# Altium project OBDII.PrjPCB
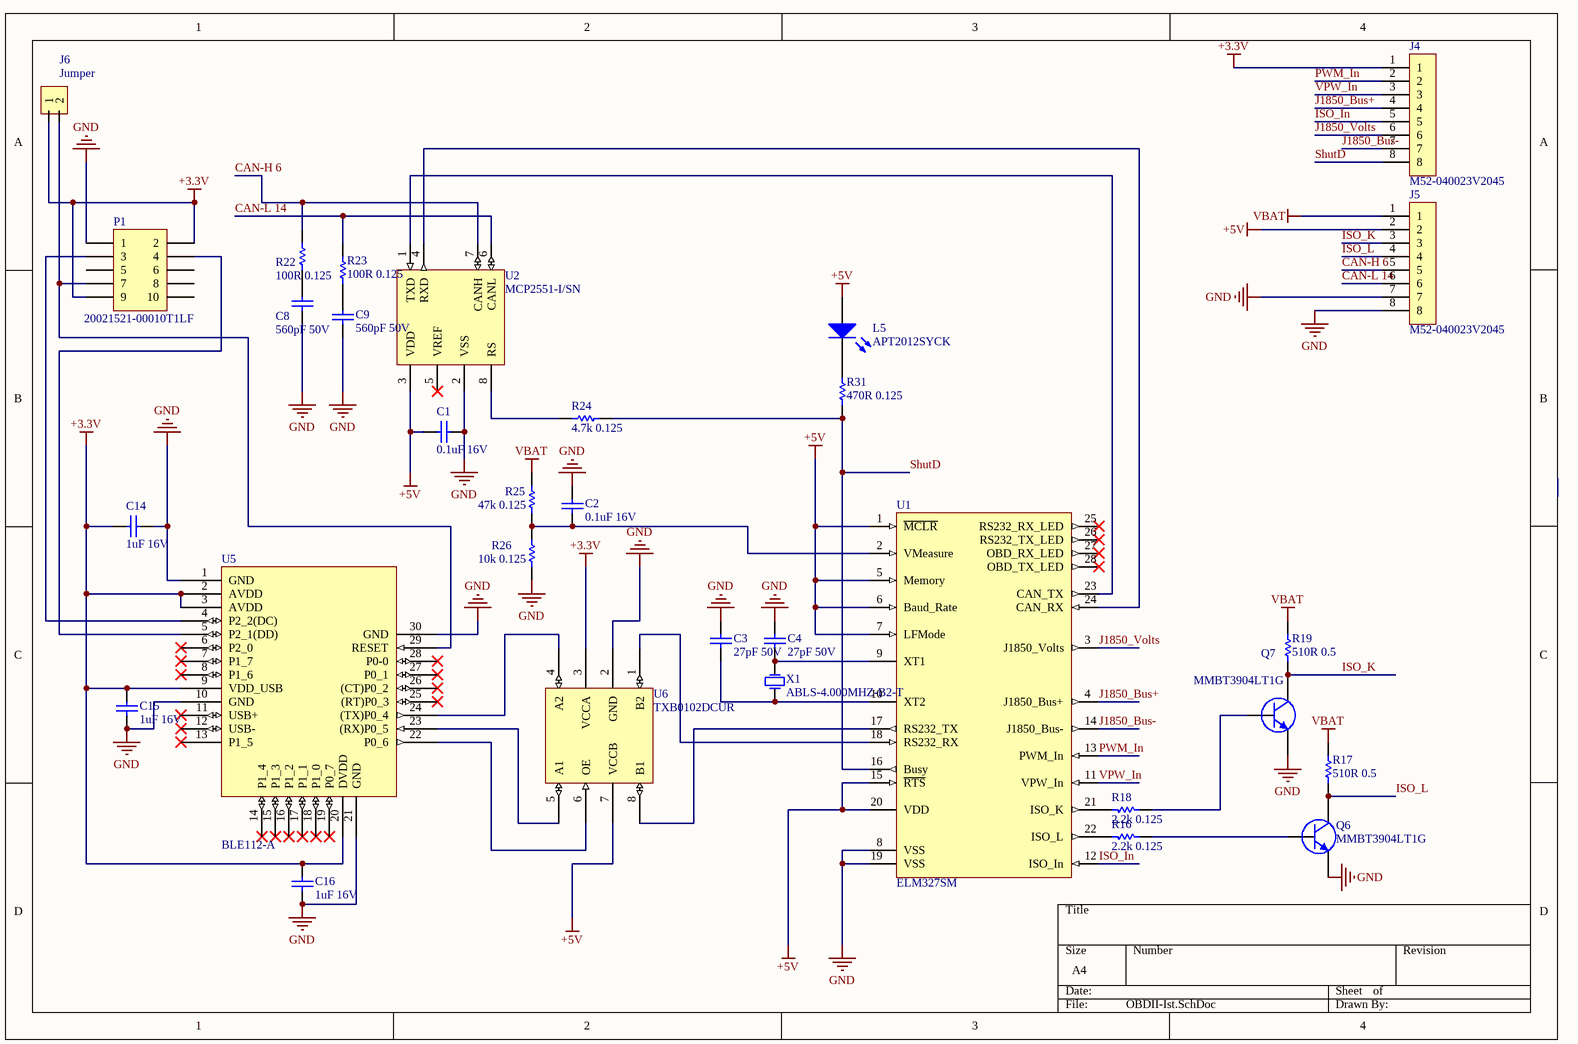
[diagram p0: OBDII-Ist.SchDoc]
2 sheets, 67 parts. Net scope: global (net labels, ports and power ports of the same name join across sheets).
Board file: OBDII-Ist.PcbDoc
Sheets:
  OBDII-Ist.SchDoc
  Power_.SchDoc

## Sheet OBDII-Ist.SchDoc
size A4

### Parts
C1  0.1uF 16V  [1608[0603]]
C2  0.1uF 16V  [1608[0603]]
C3  27pF 50V  [1608[0603]]
C4  27pF 50V  [1608[0603]]
C8  560pF 50V  [0402]
C9  560pF 50V  [0402]
C14  1uF 16V  [1608[0603]]
C15  1uF 16V  [1608[0603]]
C16  1uF 16V  [1608[0603]]
J4  M52-040023V2045  [M52-040023V2045_hols]
J5  M52-040023V2045  [M52-040023V2045_hols]
J6  Jumper  [Jumper]
L5  APT2012SYCK  [LED-0805]
P1  20021521-00010T1LF  [20021521-00010T1LF]
Q6  MMBT3904LT1G  [SOT23]
Q7  MMBT3904LT1G  [SOT23]
R16  2.2k 0.125  [ERA-0805]
R17  510R 0.5  [ERJ-1210]
R18  2.2k 0.125  [ERA-0805]
R19  510R 0.5  [ERJ-1210]
R22  100R 0.125  [ERA-0805]
R23  100R 0.125  [ERA-0805]
R24  4.7k 0.125  [ERA-0805]
R25  47k 0.125  [ERA-0805]
R26  10k 0.125  [ERA-0805]
R31  470R 0.125  [ERA-0805]
U1  ELM327SM  [SOIC-28N]
U2  MCP2551-I/SN  [SOIC8N]
U5  BLE112-A  [BLE112-A - II]
U6  TXB0102DCUR  [TXB0102DCUR]
X1  ABLS-4.000MHZ-B2-T  [HC-49/US]

### Nets
+3.3V: C14.1 C15.2 C16.2 J4.1 J6.1 P1.2 P1.9 U5.2(AVDD) U5.3(AVDD) U5.9(VDD_USB) U5.20(DVDD) U6.3(VCCA)
+5V: C1.1 J5.2 L5.1(A) U1.1(~{MCLR}) U1.5(Memory) U1.6(Baud_Rate) U1.7(LFMode) U1.15(~{RTS}) U1.20(VDD) U2.3(VDD) U6.7(VCCB)
GND: C1.2 C2.2 C3.2 C4.2 C8.1 C9.1 C14.2 C15.1 C16.1 J5.7 J5.8 P1.1 Q6.2(E) Q7.2(E) R26.1 U1.8(VSS) U1.19(VSS) U2.2(VSS) U5.1(GND) U5.10(GND) U5.21(GND) U5.30(GND) U6.2(GND)
VBAT: J5.1 R17.2 R19.2 R25.2
CAN-H 6: J5.5 R22.2 U2.7(CANH)
CAN-L 14: J5.6 R23.2 U2.6(CANL)
ISO_In: J4.5 U1.12(ISO_In)
ISO_K: J5.3 Q7.3(C) R19.1
ISO_L: J5.4 Q6.3(C) R17.1
J1850_Bus+: J4.4 U1.4(J1850_Bus+)
J1850_Bus-: J4.7 U1.14(J1850_Bus-)
J1850_Volts: J4.6 U1.3(J1850_Volts)
PWM_In: J4.2 U1.13(PWM_In)
ShutD: J4.8 R24.2 R31.1 U1.16(Busy)
VPW_In: J4.3 U1.11(VPW_In)
NetC2_1: C2.1 R25.1 R26.2 U1.2(VMeasure)
NetC3_1: C3.1 U1.10(XT2) X1.1(OSC1)
NetC4_1: C4.1 U1.9(XT1) X1.2(OSC2)
NetC8_2: C8.2 R22.1
NetC9_2: C9.2 R23.1
NetJ6_2: J6.2 P1.7 U5.29(RESET)
NetL5_2: L5.2(K) R31.2
NetP1_3: P1.3 U5.4(P2_2(DC))
NetP1_4: P1.4 U5.5(P2_1(DD))
NetQ6_1: Q6.1(B) R16.1
NetQ7_1: Q7.1(B) R18.1
NetR16_2: R16.2 U1.22(ISO_L)
NetR18_2: R18.2 U1.21(ISO_K)
NetR24_1: R24.1 U2.8(RS)
NetU1_17: U1.17(RS232_TX) U6.8(B1)
NetU1_18: U1.18(RS232_RX) U6.1(B2)
NetU1_23: U1.23(CAN_TX) U2.1(TXD)
NetU1_24: U1.24(CAN_RX) U2.4(RXD)
NetU5_22: U5.22(P0_6) U6.6(OE)
NetU5_23: U5.23((RX)P0_5) U6.5(A1)
NetU5_24: U5.24((TX)P0_4) U6.4(A2)

Not connected (* = marked no-connect by the designer): P1 5 6 8 10; U1 25(RS232_RX_LED)* 26(RS232_TX_LED)* 27(OBD_RX_LED)* 28(OBD_TX_LED)*; U2 5(VREF)*; U5 6(P2_0)* 7(P1_7)* 8(P1_6)* 11(USB+)* 12(USB-)* 13(P1_5)* 14(P1_4)* 15(P1_3)* 16(P1_2)* 17(P1_1)* 18(P1_0)* 19(P0_7)* 25((RT)P0_3)* 26((CT)P0_2)* 27(P0_1)* 28(P0-0)*

### Library data of the parts
C1 C2 = GRM188R61C104KA01D: Surface-Mount Ceramic Multilayer Capacitor, 0.1uF, X5R, 10% Tolerance, 0603 Size, 16V; PackageReference: 0603; Publisher: Altium Limited; PackageDescription: Chip Capacitor; Site: http://product.tdk.com/capacitor/mlcc/en/documents/mlccspec_automotive_general_midvoltage_en.pdf; Value: 0.1uF 16V
C3 C4 = CC0603JRNPO9BN270: Surface-Mount Ceramic Multilayer Capacitor, 27pF, 5% Tolerance, 0603 Size, 50V; PackageReference: 1608(0603); Publisher: Altium Limited; PackageDescription: Chip Capacitor; Site: http://www.mouser.com/ds/2/447/UPY-GP_NP0_16V-to-50V_%288%29-217813.pdf; Value: 27pF 50V
C8 C9 = C0402C561J5GACTU: Surface-Mount Ceramic Multilayer Capacitor, 560pF, 5% Tolerance, 0402 Size, 50V; PackageReference: 0402; Publisher: Altium Limited; PackageDescription: Chip Capacitor; Site: http://www.kemet.com/kemet/web/homepage/kechome.nsf/vapubfiles/KEM_C1003_C0G_SMD.pdf/$file/KEM_C1003_C0G_SMD.pdf; Value: 560pF 50V
C14-C16 = C1608X7R1C105K080AC: Surface-Mount Ceramic Multilayer Capacitor, 1uF, X7R, 10% Tolerance, 0603 Size, 16V; PackageReference: 1608(0603); PackageDescription: Chip Capacitor; Site: http://www.kemet.com/kemet/web/homepage/kechome.nsf/vapubfiles/KEM_C1002_X7R_SMD.pdf/$file/KEM_C1002_X7R_SMD.pdf; Value: 1uF 16V
J4 J5 = M52-040023V2045_hols: CONN HEADER .050" 8POS PCB GOLD; Manufacturer: Harwin; PartNumber: M52-040023V2045; Type: M52-040023V2045_hols
J6 = Jumper: Solder Jumper; Type: Solder Junper
L5 = APT2012SYCK: Typical BLUE SiC LED; LatestRevisionNote: PCB Footprint replaced.; PackageReference: 0805; PackageDescription: SM LED; Body 2.0x 1.25 x 0.75mm, inc leads (LxWxH typ); Type: APT2012SYCK
P1 = 20021521-00010T1LF: Header, 5-Pin, Dual row,SMT SHOULDED; LatestRevisionDate: 17-Jul-2002; LatestRevisionNote: Re-released for DXP Platform.; Publisher: Altium Limited; Type: 20021521-00010T1LF
Q6 Q7 = MMBT3904LT1G: NPN 3904 General Purpose Amplifier; Manufacturer: ON Semiconductor; Value: 0.2A, 40V; Approved: Yes by Implemenation; TargetLibrary: Transistors; Published: 8/13/2009; Publisher: Vanteon; LeadFree: Yes; RoHS: Yes; PartNumber: MMBT3904LT1G; ComponentLink1Description: Datasheet; ComponentLink1URL: http://www.onsemi.com/pub_link/Collateral/MMBT3904LT1-D.PDF; Status: Active; Supplier 1: Digi-Key; Supplier Part Number 1: MMBT3904LT1GOSCT-ND
R16 R18 = ERA-6AEB222V: Rectangular Thick Film Chip Resistor, 2.2 kOhm, 0.1% Tolerance, 0805 Size, 0.125 W; Note: If flow soldering, adjust pad width of PCB Footprint to 0.7 - 0.8 times the width of the resistor.; LatestRevisionNote: Silkscreen size reduced.; PackageReference: ERA-0805; Code_IPC: 2012 [0805]; ComponentLink1Description: Manufacturer Link; ComponentLink1URL: http://industrial.panasonic.com/www-data/pdf/AOA0000/AOA0000CE26.pdf; Value: 2.2k 0.125
R17 R19 = ERJ-14NF5100U: Rectangular Thick Film Chip Resistor, 510 Ohm, 1% Tolerance, 1210 Size, 0.5 W; Note: If flow soldering, adjust pad width of PCB Footprint to 0.7 - 0.8 times the width of the resistor.; LatestRevisionNote: Silkscreen size reduced.; PackageReference: ERA-1210; Code_IPC: 2012 [1210]; ComponentLink1Description: Manufacturer Link; ComponentLink1URL: http://industrial.panasonic.com/www-data/pdf/AOA0000/AOA0000CE26.pdf; Value: 510R 0.5
R22 R23 = ERA-6AEB101V: Rectangular Thick Film Chip Resistor, 100 Ohm, 0.1% Tolerance, 0805 Size, 0.125 W; Note: If flow soldering, adjust pad width of PCB Footprint to 0.7 - 0.8 times the width of the resistor.; LatestRevisionNote: Silkscreen size reduced.; PackageReference: ERA-0805; Code_IPC: 2012 [0805]; ComponentLink1Description: Manufacturer Link; ComponentLink1URL: http://industrial.panasonic.com/www-data/pdf/AOA0000/AOA0000CE26.pdf; Value: 100R 0.125
R24 = ERA-6AEB472V: Rectangular Thick Film Chip Resistor, 4.7 kOhm, 0.1% Tolerance, 0805 Size, 0.125 W; Note: If flow soldering, adjust pad width of PCB Footprint to 0.7 - 0.8 times the width of the resistor.; LatestRevisionNote: Silkscreen size reduced.; PackageReference: ERA-0805; Code_IPC: 2012 [0805]; ComponentLink1Description: Manufacturer Link; ComponentLink1URL: http://industrial.panasonic.com/www-data/pdf/AOA0000/AOA0000CE26.pdf; Value: 4.7k 0.125
R25 = ERA-6AEB473V: Rectangular Thick Film Chip Resistor, 47 kOhm, 0.1% Tolerance, 0805 Size, 0.125 W; Note: If flow soldering, adjust pad width of PCB Footprint to 0.7 - 0.8 times the width of the resistor.; LatestRevisionNote: Silkscreen size reduced.; PackageReference: ERA-0805; Code_IPC: 2012 [0805]; ComponentLink1Description: Manufacturer Link; ComponentLink1URL: http://industrial.panasonic.com/www-data/pdf/AOA0000/AOA0000CE26.pdf; Value: 47k 0.125
R26 = ERA-6AEB103V: Rectangular Thick Film Chip Resistor, 10 kOhm, 0.1% Tolerance, 0805 Size, 0.125 W; Note: If flow soldering, adjust pad width of PCB Footprint to 0.7 - 0.8 times the width of the resistor.; LatestRevisionNote: Silkscreen size reduced.; PackageReference: ERA-0805; Code_IPC: 2012 [0805]; ComponentLink1Description: Manufacturer Link; ComponentLink1URL: http://industrial.panasonic.com/www-data/pdf/AOA0000/AOA0000CE26.pdf; Value: 10k 0.125
R31 = ERA-6AEB471V: Rectangular Thick Film Chip Resistor, 470 Ohm, 0.1% Tolerance, 0805 Size, 0.125 W; Note: If flow soldering, adjust pad width of PCB Footprint to 0.7 - 0.8 times the width of the resistor.; LatestRevisionNote: Silkscreen size reduced.; PackageReference: ERA-0805; Code_IPC: 2012 [0805]; ComponentLink1Description: Manufacturer Link; ComponentLink1URL: http://industrial.panasonic.com/www-data/pdf/AOA0000/AOA0000CE26.pdf; Value: 470R 0.125
U1 = ELM327_SOIC: OBDII Interpreter IC; Manufacturer: Elm Electronics; PartNumber: ELM327SM; Type: ELM327SM
U2 = MCP2551-I/SN: IC TRANSCEIVER CAN HI-SPD 8-SOIC; Manufacturer: Microchip Technology; PartNumber: MCP2551-I/SN; Type: MCP2551-1/SN
U5 = BLE112-A: BLE112 Bluetooth Smart Module; Site: http://www.bluegiga.com/en-US/products/bluetooth-4.0-modules/ble112-bluetooth--smart-module/; Type: BLE112-A
U6 = TXB0102DCUR: 2-Bit Bidirectional Voltage-Level Translator with Auto Direction Sensing and +/-15-kV ESD Protect; Site: http://www.ti.com/lit/gpn/txb0102; Type: TXB0102DCUR
X1 = ABLS-4.000MHZ-B2-T: CRYSTAL 4.000 MHZ 18PF SMD; Manufacturer: Abracon; Value: 4MHz; PartNumber: ABLS-4.000MHZ-B2-T; Site: http://www.abracon.com/Resonators/abls.pdf

## Sheet Power_.SchDoc
size A4
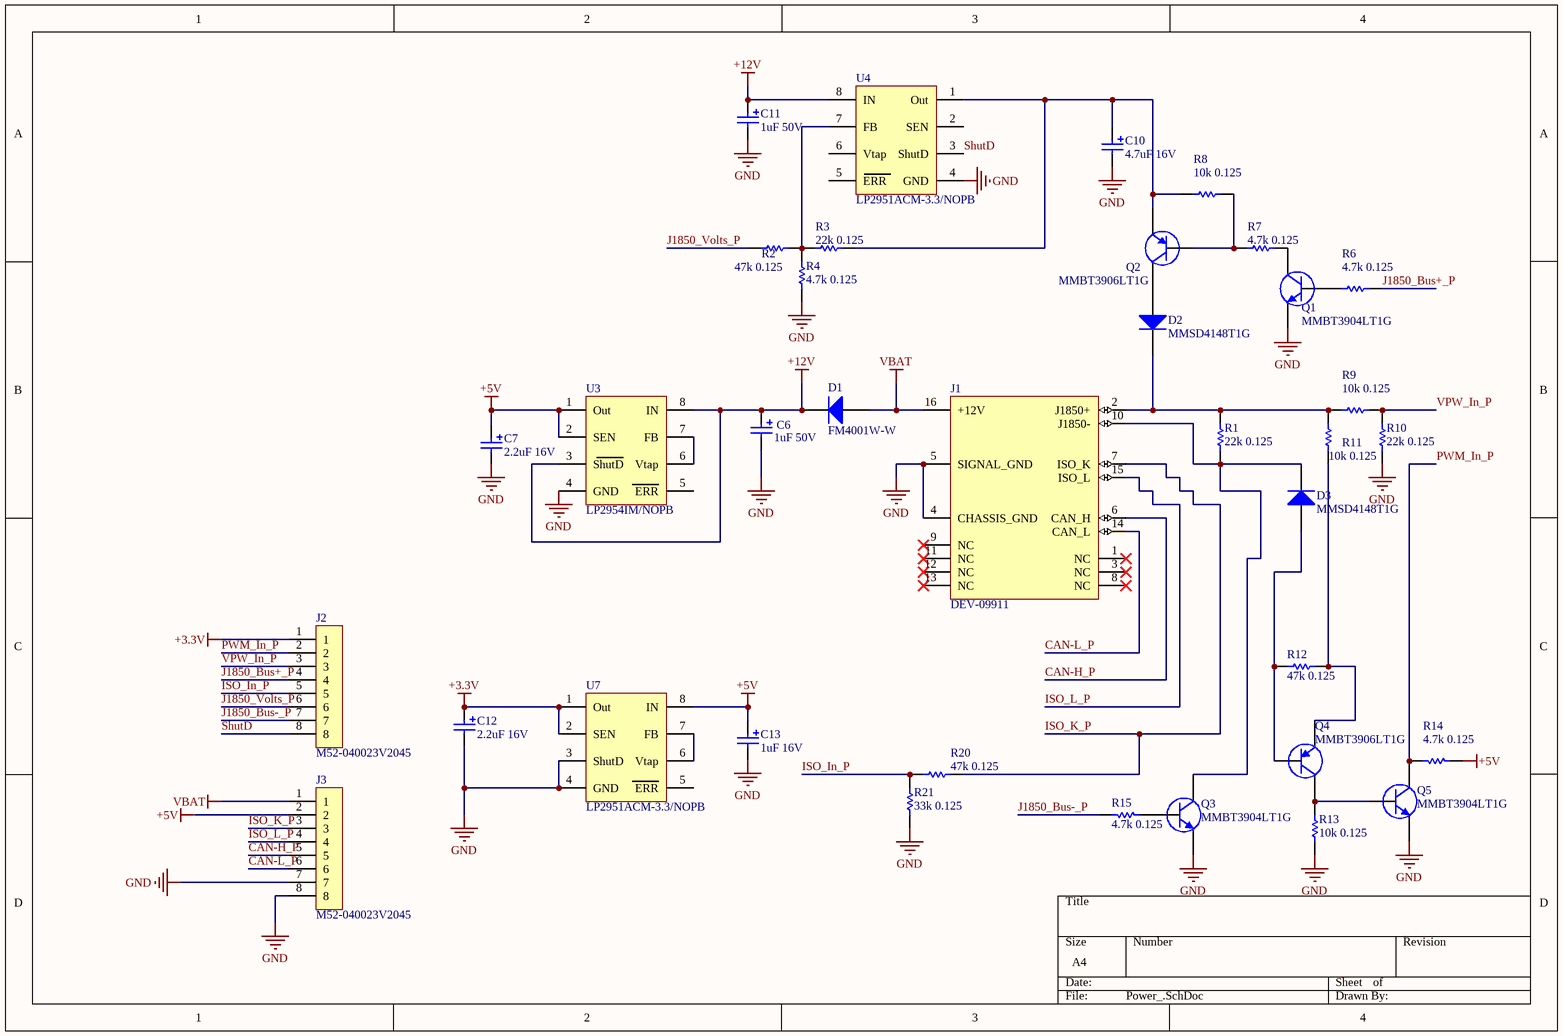
[diagram p1: Power_.SchDoc]

### Parts
C6  1uF 50V  [C1005]
C7  2.2uF 16V  [C0603]
C10  4.7uF 16V  [C1005]
C11  1uF 50V  [C1005]
C12  2.2uF 16V  [C0603]
C13  1uF 16V  [C0603]
D1  FM4001W-W  [SMA,2.8mm]
D2  MMSD4148T1G  [SOD123]
D3  MMSD4148T1G  [SOD123]
J1  DEV-09911  [DEV-09911 - II]
J2  M52-040023V2045  [M52-040023V2045]
J3  M52-040023V2045  [M52-040023V2045]
Q1  MMBT3904LT1G  [SOT23]
Q2  MMBT3906LT1G  [SOT23]
Q3  MMBT3904LT1G  [SOT23]
Q4  MMBT3906LT1G  [SOT23]
Q5  MMBT3904LT1G  [SOT23]
R1  22k 0.125  [ERA-0805]
R2  47k 0.125  [ERA-0805]
R3  22k 0.125  [ERA-0805]
R4  4.7k 0.125  [ERA-0805]
R6  4.7k 0.125  [ERA-0805]
R7  4.7k 0.125  [ERA-0805]
R8  10k 0.125  [ERA-0805]
R9  10k 0.125  [ERA-0805]
R10  22k 0.125  [ERA-0805]
R11  10k 0.125  [ERA-0805]
R12  47k 0.125  [ERA-0805]
R13  10k 0.125  [ERA-0805]
R14  4.7k 0.125  [ERA-0805]
R15  4.7k 0.125  [ERA-0805]
R20  47k 0.125  [ERA-0805]
R21  33k 0.125  [ERA-0805]
U3  LP2954IM/NOPB  [SOIC8N]
U4  LP2951ACM-3.3/NOPB  [SOIC8N]
U7  LP2951ACM-3.3/NOPB  [SOIC8N]

### Nets
+3.3V: C12.1 J2.1 U7.1(Out) U7.2(SEN)
+5V: C7.1 C13.1 J3.2 R14.1 U3.1(Out) U3.2(SEN) U7.8(IN)
+12V: C6.1 C11.1 D1.2(K) U3.3(ShutD) U3.8(IN) U4.8(IN)
GND: C6.2 C7.2 C10.2 C11.2 C12.2 C13.2 J1.4(CHASSIS_GND) J1.5(SIGNAL_GND) J3.7 J3.8 Q1.2(E) Q3.2(E) Q5.2(E) R4.1 R10.1 R13.2 R21.1 U3.4(GND) U4.4(GND) U7.3(ShutD) U7.4(GND)
VBAT: D1.1(A) J1.16(+12V) J3.1
CAN-H_P: J1.6(CAN_H) J3.5
CAN-L_P: J1.14(CAN_L) J3.6
ISO_In_P: J2.5 R20.1 R21.2
ISO_K_P: J1.7(ISO_K) J3.3 R20.2
ISO_L_P: J1.15(ISO_L) J3.4
J1850_Bus+_P: J2.4 R6.2
J1850_Bus-_P: J2.7 R15.2
J1850_Volts_P: J2.6 R2.1
PWM_In_P: J2.2 Q5.3(C) R14.2
ShutD: J2.8 U4.3(ShutD)
VPW_In_P: J2.3 R9.1 R10.2
NetC10_1: C10.1 Q2.2(E) R3.2 R8.2 U4.1(Out)
NetD2_1: D2.1(A) Q2.3(C)
NetD2_2: D2.2(C) J1.2(J1850+) R1.2 R9.2 R11.1
NetD3_1: D3.1(A) Q4.1(B) R12.1
NetD3_2: D3.2(C) J1.10(J1850-) Q3.3(C) R1.1
NetQ1_1: Q1.1(B) R6.1
NetQ1_3: Q1.3(C) R7.2
NetQ2_1: Q2.1(B) R7.1 R8.1
NetQ3_1: Q3.1(B) R15.1
NetQ4_2: Q4.2(E) R11.2 R12.2
NetQ4_3: Q4.3(C) Q5.1(B) R13.1
NetR2_2: R2.2 R3.1 R4.2 U4.7(FB)
NetU3_6: U3.6(Vtap) U3.7(FB)
NetU7_6: U7.6(Vtap) U7.7(FB)

Not connected (* = marked no-connect by the designer): J1 1(NC)* 3(NC)* 8(NC)* 9(NC)* 11(NC)* 12(NC)* 13(NC)*; U3 5(ERR); U4 2(SEN) 5(ERR) 6(Vtap); U7 5(ERR)

### Library data of the parts
C6 C11 = 298D105X0050P2T: Surface-Mount Electrolitic Tantalum Capacitor, 1uF, 20% Tolerance, 1005 Size, 50V; Type: Polarity; PackageReference: 1005; Publisher: Altium Limited; PackageDescription: Chip Capacitor; Site: http://www.vishay.com/doc?40065; Value: 1uF 50V
C7 C12 = 298D225X0016M2T: Surface-Mount Electrolitic Tantalum Capacitor, 2.2uF, 10% Tolerance, 0603 Size, 16V; Type: Polarity; PackageReference: 0603; Publisher: Altium Limited; PackageDescription: Chip Capacitor; Site: http://www.vishay.com/doc?40065; Value: 2.2uF 16V
C10 = 298D475X0016P2T: Surface-Mount Electrolitic Tantalum Capacitor, 4.7uF, 20% Tolerance, 1005 Size, 16V; Type: Polarity; PackageReference: 1005; Publisher: Altium Limited; PackageDescription: Chip Capacitor; Site: http://www.vishay.com/doc?40065; Value: 4.7uF 16V
C13 = 298D105X9016M2T: Surface-Mount Electrolitic Tantalum Capacitor, 1uF, 10% Tolerance, 0603 Size, 16V; Type: Polarity; PackageReference: 0603; Publisher: Altium Limited; PackageDescription: Chip Capacitor; Site: http://www.vishay.com/doc?40065; Value: 1uF 16V
D1 = FM4001W-W: 1 Amp 50V  Rectifier; PackageReference: DO214AC(SMA); ComponentLink1Description: Datasheet; ComponentLink1URL: http://lib.chipdip.ru/758/DOC000758182.pdf; Type: FM4001W-W
D2 D3 = MMSD4148T1G: High Conductance Fast Diode; Manufacturer: OnSemi; Approved: M. Jablonski; TargetLibrary: Diodes; Current: 200 mA; Published: 6/4/2009; Publisher: Vanteon; LeadFree: Yes; RoHS: Yes; PartNumber: MMSD4148T1G; ComponentLink1Description: Datasheet; ComponentLink1URL: http://www.onsemi.com/pub_link/Collateral/MMSD4148T1-D.PDF; Status: Active; Supplier 1: Digi-Key; Supplier Part Number 1: MMSD4148T1GOSCT-ND; Type: MMSD4148T1G
J1 = OBDII_DEV-09911: OBD-II Connector; Manufacturer: SparkFun Electronics; PartNumber: DEV-09911; Type: DEV-09911
J2 J3 = M52-040023V2045: CONN HEADER .050" 20POS PCB GOLD; Manufacturer: Harwin; PartNumber: M52-040023V2045; Type: M52-040023V2045
Q1 Q3 Q5 = MMBT3904LT1G: as Q6 on sheet OBDII-Ist; Published: 8/13/2009; Publisher: Vanteon; LeadFree: Yes; RoHS: Yes; PartNumber: MMBT3904LT1G; ComponentLink1Description: Datasheet; ComponentLink1URL: http://www.onsemi.com/pub_link/Collateral/MMBT3904LT1-D.PDF; Status: Active; Supplier 1: Digi-Key; Supplier Part Number 1: MMBT3904LT1GOSCT-ND
Q2 Q4 = MMBT3906LT1G: PNP 3906 General Purpose Amplifier; Manufacturer: ON Semiconductor; Value: 0.2A, -40V; Approved: Yes by Implemenation; TargetLibrary: Transistors; Published: 8/13/2009; Publisher: Vanteon; LeadFree: Yes; RoHS: Yes; PartNumber: MMBT3906LT1G; ComponentLink1Description: Datasheet; ComponentLink1URL: http://www.onsemi.com/pub_link/Collateral/MMBT3906LT1-D.PDF; Status: Active; Supplier 1: Digi-Key; Supplier Part Number 1: MMBT3906LT1GOSCT-ND
R1 R3 R10 = ERA-6AEB223V: Rectangular Thick Film Chip Resistor, 22 kOhm, 0.1% Tolerance, 0805 Size, 0.125 W; Note: If flow soldering, adjust pad width of PCB Footprint to 0.7 - 0.8 times the width of the resistor.; LatestRevisionNote: Silkscreen size reduced.; PackageReference: ERA-0805; Code_IPC: 2012 [0805]; ComponentLink1Description: Manufacturer Link; ComponentLink1URL: http://industrial.panasonic.com/www-data/pdf/AOA0000/AOA0000CE26.pdf; Value: 22k 0.125
R2 R12 R20 = ERA-6AEB473V: as R25 on sheet OBDII-Ist; LatestRevisionNote: Silkscreen size reduced.; PackageReference: ERA-0805; Code_IPC: 2012 [0805]; ComponentLink1Description: Manufacturer Link; ComponentLink1URL: http://industrial.panasonic.com/www-data/pdf/AOA0000/AOA0000CE26.pdf; Value: 47k 0.125
R4 R6 R7 R14 R15 = ERA-6AEB472V: as R24 on sheet OBDII-Ist; LatestRevisionNote: Silkscreen size reduced.; PackageReference: ERA-0805; Code_IPC: 2012 [0805]; ComponentLink1Description: Manufacturer Link; ComponentLink1URL: http://industrial.panasonic.com/www-data/pdf/AOA0000/AOA0000CE26.pdf; Value: 4.7k 0.125
R8 R9 R11 R13 = ERA-6AEB103V: as R26 on sheet OBDII-Ist; LatestRevisionNote: Silkscreen size reduced.; PackageReference: ERA-0805; Code_IPC: 2012 [0805]; ComponentLink1Description: Manufacturer Link; ComponentLink1URL: http://industrial.panasonic.com/www-data/pdf/AOA0000/AOA0000CE26.pdf; Value: 10k 0.125
R21 = ERA-6AEB333V: Rectangular Thick Film Chip Resistor, 33 kOhm, 0.1% Tolerance, 0805 Size, 0.125 W; Note: If flow soldering, adjust pad width of PCB Footprint to 0.7 - 0.8 times the width of the resistor.; LatestRevisionNote: Silkscreen size reduced.; PackageReference: ERA-0805; Code_IPC: 2012 [0805]; ComponentLink1Description: Manufacturer Link; ComponentLink1URL: http://industrial.panasonic.com/www-data/pdf/AOA0000/AOA0000CE26.pdf; Value: 33k 0.125
U3 = LP2954IM/NOPB: LDO Voltage Regulators  1.2V-29V 0.25A SOIC8; Manufacturer: Texas Instruments; Approved: Yes by Implementation; TargetLibrary: Power IC; PartNumber: LP2954IM/NOPB; ComponentLink1Description: Datasheet; ComponentLink1URL: http://www.ti.com/general/docs/lit/getliterature.tsp?literatureNumber=snvs764n; LeadFree: Yes; RoHS: Yes; Status: Active; Supplier 1: Digi-Key; Supplier Part Number 1: LP2954IM/NOPB; Type: LP2954IM/NOPB
U4 U7 = LP2951ACM-3.3/NOPB: LDO Voltage Regulators  1.2V-37V 0.1A SOIC8; Manufacturer: Texas Instruments; Approved: Yes by Implementation; TargetLibrary: Power IC; PartNumber: LP2951ACM-3.3/NOPB; ComponentLink1Description: Datasheet; ComponentLink1URL: http://www.ti.com/general/docs/lit/getliterature.tsp?literatureNumber=snvs764n; LeadFree: Yes; RoHS: Yes; Status: Active; Supplier 1: Digi-Key; Supplier Part Number 1: LP2951ACM-3.3/NOPB; Type: LP2951ACM-3.3/NOPB

## Nets that join several sheets
+3.3V: OBDII-Ist (12 pins), Power_ (C12.1 J2.1 U7.1 U7.2)
+5V: OBDII-Ist (11 pins), Power_ (7 pins)
GND: OBDII-Ist (23 pins), Power_ (21 pins)
VBAT: OBDII-Ist (J5.1 R17.2 R19.2 R25.2), Power_ (D1.1 J1.16 J3.1)
ShutD: OBDII-Ist (J4.8 R24.2 R31.1 U1.16), Power_ (J2.8 U4.3)